# Altium schematic sheet EncoderHeader.SchDoc
size A4
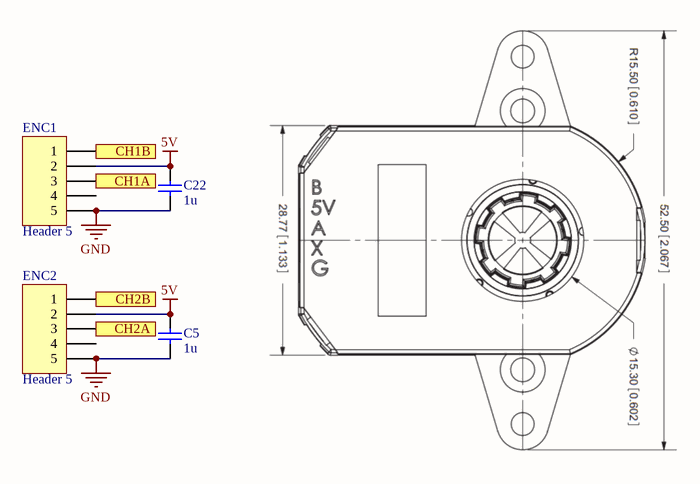
[diagram p0: EncoderHeader.SchDoc]

## Parts
C5  value 1u  [CAPC1608X90N]  (hidden comment: Cap)
C22  value 1u  [CAPC1608X90N]  (hidden comment: Cap)
ENC1  Header 5  [HDR1X5]
ENC2  Header 5  [HDR1X5]

## Ports
CH1A (out), CH1B (out), CH2A (out), CH2B (out)

## Nets
5V: C5.2 C22.2 ENC1.2 ENC2.2
GND: C5.1 C22.1 ENC1.5 ENC2.5
CH1A: ENC1.3 ; port CH1A
CH1B: ENC1.1 ; port CH1B
CH2A: ENC2.3 ; port CH2A
CH2B: ENC2.1 ; port CH2B

Not connected (* = marked no-connect by the designer): ENC1 4; ENC2 4

## Library data of the parts
C5 C22 = Cap: Capacitor; Published: 8-Jun-2000; LatestRevisionDate: 17-Jul-2002; LatestRevisionNote: Re-released for DXP Platform.; PackageReference: RAD-0.3; Publisher: Altium Limited; PackageDescription: Radial Cap, Thru-Hole; 2 Leads; 0.3 in Pin Spacing
ENC1 ENC2 = Header 5: Header, 5-Pin; LatestRevisionDate: 17-Jul-2002; LatestRevisionNote: Re-released for DXP Platform.; Publisher: Altium Limited